# Altium schematic sheet schematic.SchDoc
size A4; SheetNumber: 6; SheetTotal: 29
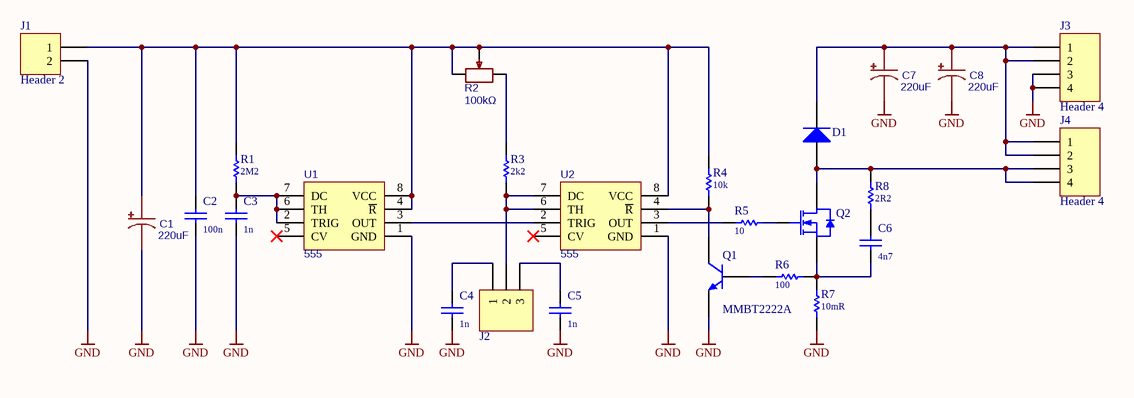
[diagram p0: schematic.SchDoc]

## Parts
C1  220uF  [C7343]
C2  100n  [C0603]
C3  1n  [C0603]
C4  1n  [C0603]
C5  1n  [C0603]
C6  4n7  [C0805]
C7  220uF  [CAP-TH_BD16.0-P7.50-D1.2-FD]
C8  220uF  [CAP-TH_BD16.0-P7.50-D1.2-FD]
D1  (no value)  [SMB]
J1  Header 2  [HDR-1X2]  (no BOM)
J2  (no value)  [HDR-1X3]  (no BOM)
J3  Header 4  [HDR-1X4]  (no BOM)
J4  Header 4  [HDR-1X4]  (no BOM)
Q1  MMBT2222A  [SOT-23]
Q2  (no value)  [D2PAK]
R1  2M2  [R0603]
R2  100kΩ  [RES-ADJ-TH_3362P-1-104LF]
R3  2k2  [R0603]
R4  10k  [R0603]
R5  10  [R0603]
R6  100  [R0603]
R7  10mR  [R2512-WIDE]
R8  2R2  [R1206]
U1  555  [SOIC-8]
U2  555  [SOIC-8]

## Nets
GND: C1.2 C2.1 C3.1 C4.1 C5.1 C7.2 C8.2 J1.2 J3.3 J3.4 Q1.2(E) R7.1 U1.1(GND) U2.1(GND)
NetC1_1: C1.1 C2.2 J1.1 R1.2 R2.2 R2.3 R4.2 U1.4(~{R}) U1.8(VCC) U2.8(VCC)
NetC3_2: C3.2 R1.1 U1.2(TRIG) U1.6(TH) U1.7(DC)
NetC4_2: C4.2 J2.1
NetC5_2: C5.2 J2.3
NetC6_1: C6.1 Q2.3(SOURCE) R6.1 R7.2
NetC6_2: C6.2 R8.1
NetC7_1: C7.1 C8.1 D1.2(K) J3.1 J3.2 J4.1 J4.2
NetD1_1: D1.1(A) J4.3 J4.4 Q2.2(DRAIN) R8.2
NetJ2_2: J2.2 R3.1 U2.6(TH) U2.7(DC)
NetQ1_1: Q1.1(B) R6.2
NetQ1_3: Q1.3(C) R4.1 U2.4(~{R})
NetQ2_1: Q2.1(GATE) R5.1
NetR2_1: R2.1 R3.2
NetR5_2: R5.2 U2.3(OUT)
NetU1_3: U1.3(OUT) U2.2(TRIG)

Not connected (* = marked no-connect by the designer): U1 5(CV)*; U2 5(CV)*

## Library data of the parts
C2-C6 = CAP
D1 = US1M-13-F
J2 = Header 3
Q1 = MMBT2222ALT1G
Q2 = 2N7002
R1 R3-R6 R8 = RES_0402_1K5-1%
R2 = 100kΩ: 3362P-1-104LF
R7 = RES